# EAGLE schematic DDS_Module_r3 (EAGLE 7.7.0)
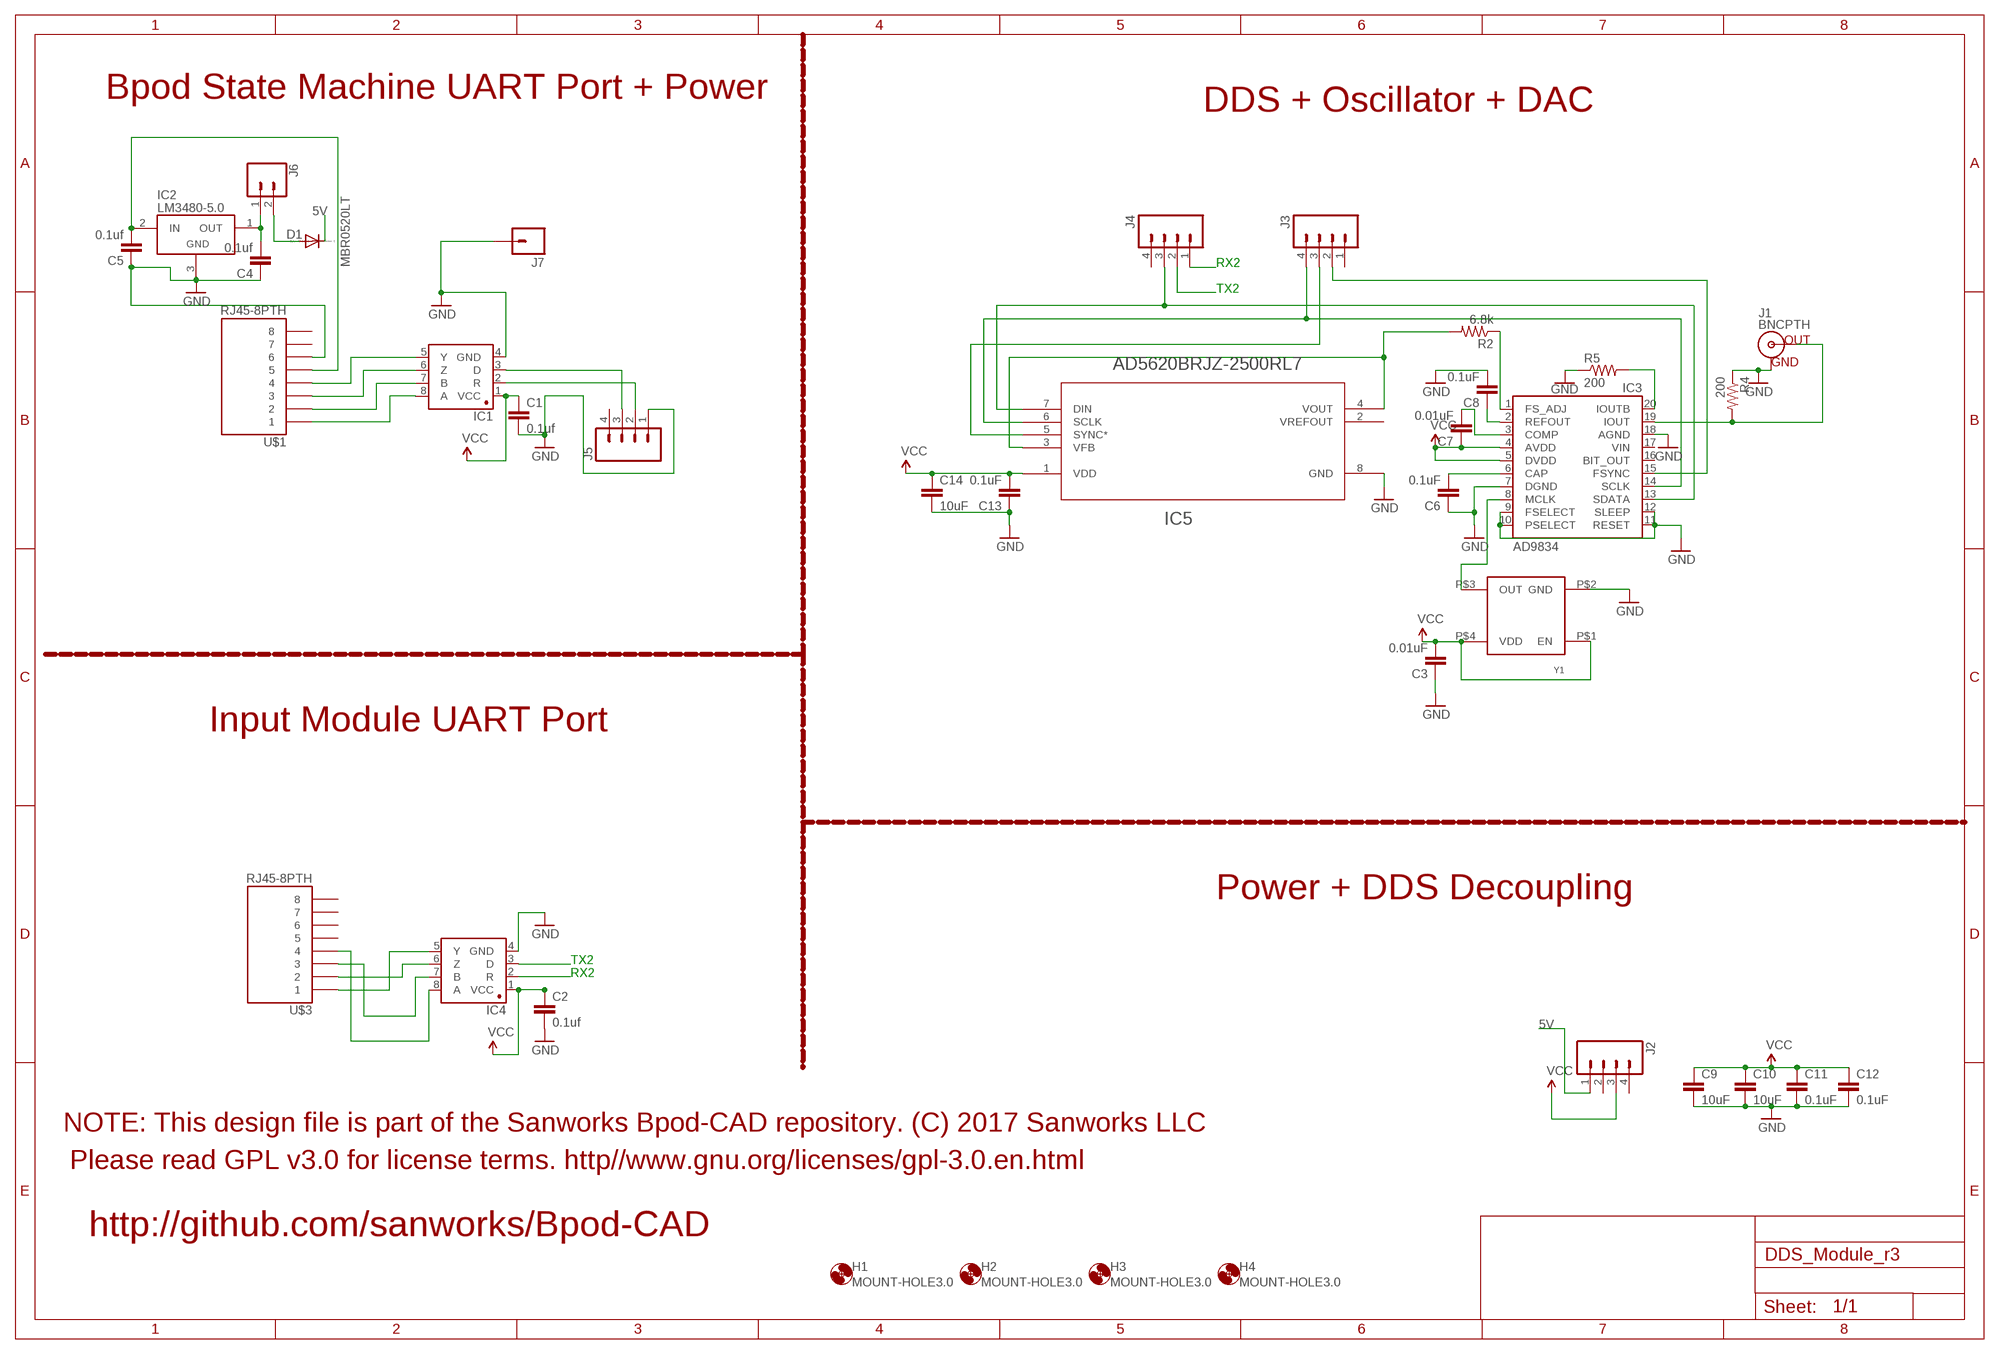
[diagram p0: schematic, sheet 1]

## Parts
C1  0.1uf  CAP1206  [1206@1]
C2  0.1uf  CAP1206  [1206@1]
C3  0.01uF  10UF-0805-10V-10%  [0805]
C4  0.1uf  CAP1206  [1206@1]
C5  0.1uf  CAP1206  [1206@1]
C6  0.1uF  10UF-0805-10V-10%  [0805]
C7  0.01uF  10UF-0805-10V-10%  [0805]
C8  0.1uF  10UF-0805-10V-10%  [0805]
C9  10uF  10UF-0805-10V-10%  [0805]
C10  10uF  10UF-0805-10V-10%  [0805]
C11  0.1uF  10UF-0805-10V-10%  [0805]
C12  0.1uF  10UF-0805-10V-10%  [0805]
C13  0.1uF  10UF-0805-10V-10%  [0805]
C14  10uF  10UF-0805-10V-10%  [0805]
D1  MBR0520LT  [SOD123]
H1  MOUNT-HOLE3.0  [3,0]
H2  MOUNT-HOLE3.0  [3,0]
H3  MOUNT-HOLE3.0  [3,0]
H4  MOUNT-HOLE3.0  [3,0]
IC1  SN65HVD31DR  [SO08]
IC2  LM3480-5.0  [SOT-23-3]
IC3  AD9834  [TSSOP20]
IC4  SN65HVD31DR  [SO08]
IC5  AD5620BRJZ-2500RL7  [RJ_8]
J1  BNCPTH  [BNC]
J2  M04PTH  [1X04]
J3  M04PTH  [1X04]
J4  M04PTH  [1X04]
J5  M04PTH  [1X04]
J6  CONN_02  [1X02]
J7  M01PTH  [1X01]
R2  6.8k  R-US_R0805  [R0805]
R4  200  R-US_R0805  [R0805]
R5  200  R-US_R0805  [R0805]
U$1  RJ45-8PTH  [RJ45-8]
U$3  RJ45-8PTH  [RJ45-8]
Y1  ASE10MHZ  [ASE10MHZ]

## Nets
5V: D1.C J2.1
GND: C1.2 C2.2 C3.1 C4.1 C5.1 C6.1 C8.2 C9.2 C10.2 C11.2 C12.2 C13.1 C14.2 IC1.4(GND) IC2.3(GND) IC3.7(DGND) IC3.9(FSELECT) IC3.10(PSELECT) IC3.11(RESET) IC3.12(SLEEP) IC3.18(AGND) IC4.4(GND) IC5.8(GND) J1.GND J5.1 J7.1 R4.1 R5.1 U$1.6 Y1.P$2(GND)
N$1: IC3.13(SDATA) IC5.7(DIN) J4.3
N$2: IC3.14(SCLK) IC5.6(SCLK) J3.4
N$3: IC5.5(SYNC*) J3.3
N$4: IC3.20(IOUTB) R5.2
N$5: IC3.15(FSYNC) J3.2
N$6: IC3.1(FS_ADJ) R2.1
N$7: IC1.8(A) U$1.1
N$8: IC1.7(B) U$1.2
N$9: IC1.6(Z) U$1.3
N$10: IC1.5(Y) U$1.4
N$11: IC5.3(VFB) IC5.4(VOUT) R2.2
N$12: IC3.8(MCLK) Y1.P$3(OUT)
N$13: IC3.19(IOUT) J1.S(OUT) R4.2
N$14: C4.2 IC2.1(OUT) J6.1
N$15: C6.2 IC3.6(CAP)
N$16: C7.2 IC3.3(COMP)
N$17: C8.1 IC3.2(REFOUT)
N$18: D1.A J6.2
N$21: IC4.5(Y) U$3.1
N$22: IC4.6(Z) U$3.2
N$23: IC4.7(B) U$3.3
N$24: C5.2 IC2.2(IN) U$1.5
N$25: IC4.8(A) U$3.4
RX1: IC1.2(R) J5.2
RX2: IC4.2(R) J4.1
TX1: IC1.3(D) J5.3
TX2: IC4.3(D) J4.2
VCC: C1.1 C2.1 C3.2 C7.1 C9.1 C10.1 C11.1 C12.1 C13.2 C14.1 IC1.1(VCC) IC3.4(AVDD) IC3.5(DVDD) IC4.1(VCC) IC5.1(VDD) J2.3 Y1.P$1(EN) Y1.P$4(VDD)
Unconnected: IC3.16(BIT_OUT) IC3.17(VIN) IC5.2(VREFOUT) J2.2 J2.4 J3.1 J4.4 J5.4 U$1.7 U$1.8 U$3.5 U$3.6 U$3.7 U$3.8

## Notes on the sheet
- Bpod State Machine UART Port + Power
- DDS + Oscillator + DAC
- 5V
- RX2
- TX2
- Input Module UART Port
- Power + DDS Decoupling
- TX2
- RX2
- 5V
- NOTE: This design file is part of the Sanworks Bpod-CAD repository. (C) 2017 Sanworks LLC
- Please read GPL v3.0 for license terms. http//www.gnu.org/licenses/gpl-3.0.en.html
- http://github.com/sanworks/Bpod-CAD

## Library data of the parts
C1 C2 C4 C5 = SparkFun-Capacitors:CAP: Capacitor Standard 0603 ceramic capacitor, and 0.1" leaded capacitor.
C3 C6-C8 C11-C13 = SparkFun-Capacitors:10UF: 10.0µF ceramic capacitors A capacitor is a passive two-terminal electrical component used to store electrical energy temporarily in an electric field.; PROD_ID: CAP-11330; VALUE: 10uF
C9 C10 C14 = SparkFun-Capacitors:10UF: 10.0µF ceramic capacitors A capacitor is a passive two-terminal electrical component used to store electrical energy temporarily in an electric field.; PROD_ID: CAP-11330
D1 = diode:MBR0520LT: SCHOTTKY BARRIER RECTIFIER Source: http://onsemi.com .. MBR0520LT1-D.pdf
H1-H4 = holes:MOUNT-HOLE: MOUNTING HOLE with drill center marker
IC1 IC4 = Joshparts4:SN65HVD31DR: A placeholder for generic narrow & wide SOIC8 foorptints - used on the DIP adapter board.
IC2 = regulators:LM3480-*: National Semiconductor LM3480 100 mA, SOT-23, quasi-LDO linear regulator
IC3 = tft:AD9834
IC5 = AD5620:AD5620BRJZ-2500RL7; MANUFACTURER_PART_NUMBER: AD5620BRJZ2500RL7; VENDOR: Vendor
J1 = SparkFun-Connectors:BNC: BNC Right Angle Connector Mouser Part# 5227161 SparkFun Products: BNC Connector - Right Angle <https://www.sparkfun.com/products/10550>; PROD_ID: LPA-12729; SF_ID: PRT-10550
J2-J5 = SparkFun-Connectors:M04: Header 4 Standard 4-pin 0.1" header. Use with straight break away headers (SKU : PRT-00116), right angle break away headers (PRT-00553), swiss pins (PRT-00743), machine pins (PRT-00117), and female headers (PRT-00115). Molex polarized connector foot print use with SKU : PRT-08231 with associated crimp pins and housings. 1MM SMD Version SKU: PRT-10208; PROD_ID: CONN-09696
J6 = SparkFun-Connectors:CONN_02: Multi connection point. Often used as Generic Header-pin footprint for 0.1 inch spaced/style header connections On any of the 0.1 inch spaced packages, you can populate with these: Break Away Headers - Straight <https://www.sparkfun.com/products/116> (PRT-00116) Break Away Male Headers - Right Angle <https://www.sparkfun.com/products/553> (PRT-00553) Female Headers <https://www.sparkfun.com/products/115> (PRT-00115) Break Away Headers - Machine Pin <https://www.sparkfun.com/products/117> (PRT-00117) Break Away Female Headers - Swiss Machine Pin <https://www.sparkfun.com/products/743> (PRT-00743) For SCREWTERMINALS and SPRING TERMINALS visit here: Screw Terimnals on SparkFun.com <https://www.sparkfun.com/search/results?term=Screw+Terminals> (5mm/3.5mm/2.54mm spacing) This device is also useful as a general connection point to wire up your design to another part of your project. Our various solder wires solder well into these plated through hole pads. Hook-Up Wire - Assortment (Stranded, 22 AWG) <https://www.sparkfun.com/products/11375> (PRT-11375) Hook-Up Wire - Assortment (Solid Core, 22 AWG) <https://www.sparkfun.com/products/11367> (PRT-11367) View the entire wire category on our website here <https://www.sparkfun.com/categories/141> Special notes: Molex polarized connector foot print use with: PRT-08233 with associated crimp pins and housings. 2.54_SCREWTERM for use with PRT-10571. 3.5mm Screw Terminal footprints for PRT-08084 5mm Screw Terminal footprints for use with PRT-08432
J7 = SparkFun-Connectors:M01: Header 1 Standard 1-pin 0.1" header. Use with straight break away headers (SKU : PRT-00116), right angle break away headers (PRT-00553), swiss pins (PRT-00743), machine pins (PRT-00117), and female headers (PRT-00115). SMTSO-256-ET is a "flush mount" nut for a 4-40 screw. The older package used to be too tight, and did not allow it to sit properly thru the drill hit. The latest (0.165DIA) fits nice and snug.
R2 R4 R5 = adafruit:R-US_: RESISTOR, American symbol
U$1 U$3 = SparkFun:RJ45-8: RJ45 Jack Simple RJ45, 8-pin connection - connector for common Cat5, Cat5e, and Cat6 Ethernet cables. Footprint not yet proven in production. Connector sku is PRT-00643; Breakout PCB sku is BOB-00716.
Y1 = JoshParts10:ASE10MHZ